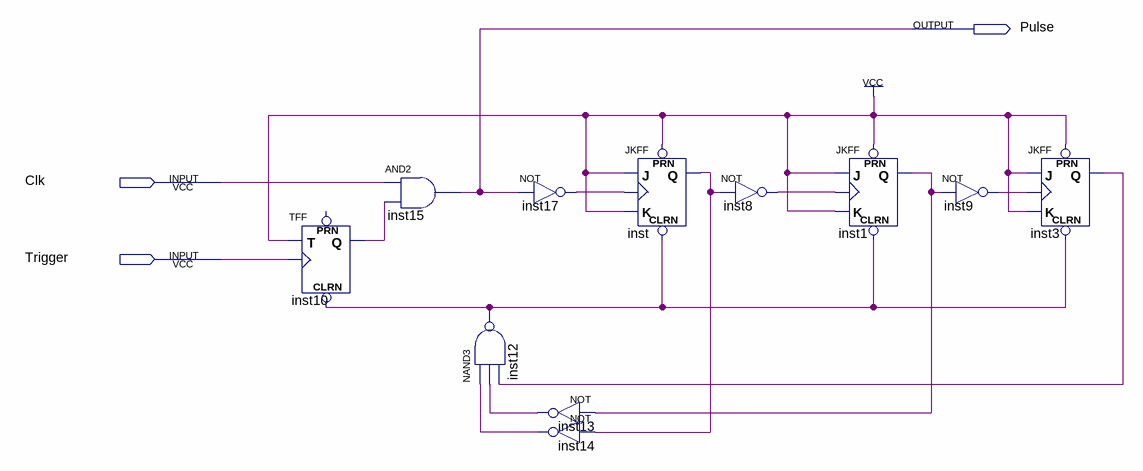
[diagram p0: schematic sheet]
// Quartus schematic Pulse_Generator.bdf as structural Verilog: 11 symbols, 3 pins
module Pulse_Generator (
  input  Clk,
  input  Trigger,
  output Pulse
);

  wire inst1_q, inst3_q, inst8_out, inst9_out, inst10_q, inst12_out, inst13_out, inst14_out, inst17_out,
       inst_q;

  TFF inst10 (.CLRN(inst12_out), .T(1'b1), .CLK(Trigger), .Q(inst10_q));  // open: PRN
  and inst15 (Pulse, Clk, inst10_q);
  not inst17 (inst17_out, Pulse);
  nand inst12 (inst12_out, inst14_out, inst13_out, inst3_q);
  not inst13 (inst13_out, inst1_q);
  not inst14 (inst14_out, inst_q);
  JKFF inst (.PRN(1'b1), .CLRN(inst12_out), .K(1'b1), .J(1'b1), .CLK(inst17_out), .Q(inst_q));
  not inst8 (inst8_out, inst_q);
  JKFF inst1 (.PRN(1'b1), .CLRN(inst12_out), .K(1'b1), .J(1'b1), .CLK(inst8_out), .Q(inst1_q));
  not inst9 (inst9_out, inst1_q);
  JKFF inst3 (.PRN(1'b1), .CLRN(inst12_out), .K(1'b1), .J(1'b1), .CLK(inst9_out), .Q(inst3_q));
endmodule
